# EAGLE schematic F6O2JSZITCH0EP8 (1) (EAGLE 7.6.0)
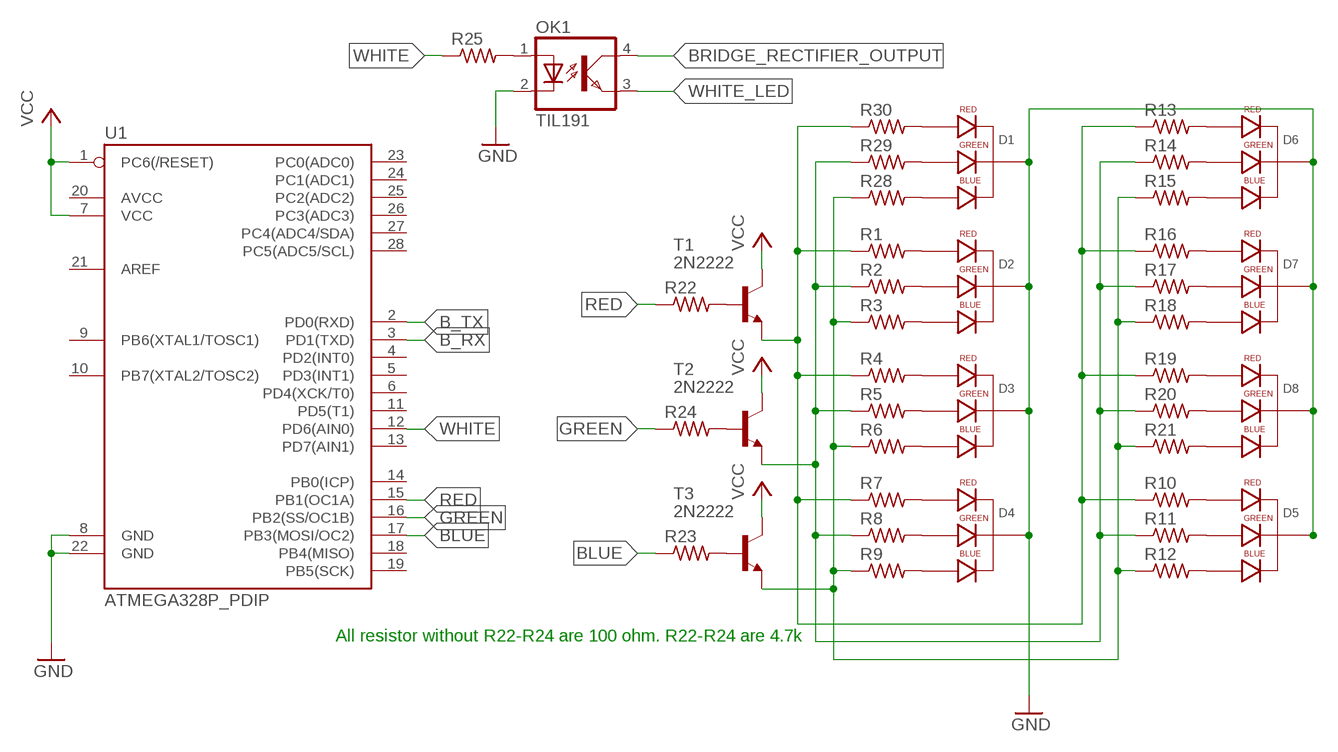
[diagram p0: schematic, sheet 1]

## Parts
D1  LED-RGB-CC-THRUCLEAR  [LED-RGB-THRU]
D2  LED-RGB-CC-THRUCLEAR  [LED-RGB-THRU]
D3  LED-RGB-CC-THRUCLEAR  [LED-RGB-THRU]
D4  LED-RGB-CC-THRUCLEAR  [LED-RGB-THRU]
D5  LED-RGB-CC-THRUCLEAR  [LED-RGB-THRU]
D6  LED-RGB-CC-THRUCLEAR  [LED-RGB-THRU]
D7  LED-RGB-CC-THRUCLEAR  [LED-RGB-THRU]
D8  LED-RGB-CC-THRUCLEAR  [LED-RGB-THRU]
OK1  TIL191  [DIL04]
R1  R-US_0309/10  [0309/10]
R2  R-US_0309/10  [0309/10]
R3  R-US_0309/10  [0309/10]
R4  R-US_0309/10  [0309/10]
R5  R-US_0309/10  [0309/10]
R6  R-US_0309/10  [0309/10]
R7  R-US_0309/10  [0309/10]
R8  R-US_0309/10  [0309/10]
R9  R-US_0309/10  [0309/10]
R10  R-US_0309/10  [0309/10]
R11  R-US_0309/10  [0309/10]
R12  R-US_0309/10  [0309/10]
R13  R-US_0309/10  [0309/10]
R14  R-US_0309/10  [0309/10]
R15  R-US_0309/10  [0309/10]
R16  R-US_0309/10  [0309/10]
R17  R-US_0309/10  [0309/10]
R18  R-US_0309/10  [0309/10]
R19  R-US_0309/10  [0309/10]
R20  R-US_0309/10  [0309/10]
R21  R-US_0309/10  [0309/10]
R22  R-US_0309/10  [0309/10]
R23  R-US_0309/10  [0309/10]
R24  R-US_0309/10  [0309/10]
R25  R-US_0309/10  [0309/10]
R28  R-US_0309/10  [0309/10]
R29  R-US_0309/10  [0309/10]
R30  R-US_0309/10  [0309/10]
T1  2N2222  [TO18]
T2  2N2222  [TO18]
T3  2N2222  [TO18]
U1  ATMEGA328P_PDIP  [DIL28-3]

## Nets
B_RX: U1.3(PD1(TXD))
B_TX: U1.2(PD0(RXD))
BLUE: R23.1 U1.17(PB3(MOSI/OC2))
BRIDGE_RECTIFIER_OUTPUT: OK1.4(COL)
GND: D1.2(CATHODE) D2.2(CATHODE) D3.2(CATHODE) D4.2(CATHODE) D5.2(CATHODE) D6.2(CATHODE) D7.2(CATHODE) D8.2(CATHODE) OK1.2(C) U1.8(GND) U1.22(GND)
GREEN: R24.1 U1.16(PB2(SS/OC1B))
N$1: OK1.1(A) R25.2
N$2: D1.1(RED_CATHODE) R30.2
N$3: D1.3(GREEN_CATHODE) R29.2
N$4: D1.4(BLUE_CATHODE) R28.2
N$5: D2.1(RED_CATHODE) R1.2
N$6: D2.3(GREEN_CATHODE) R2.2
N$7: D2.4(BLUE_CATHODE) R3.2
N$8: D3.1(RED_CATHODE) R4.2
N$9: D3.3(GREEN_CATHODE) R5.2
N$10: D3.4(BLUE_CATHODE) R6.2
N$11: D4.1(RED_CATHODE) R7.2
N$12: D4.3(GREEN_CATHODE) R8.2
N$13: D4.4(BLUE_CATHODE) R9.2
N$14: D5.1(RED_CATHODE) R10.2
N$15: D5.3(GREEN_CATHODE) R11.2
N$16: D5.4(BLUE_CATHODE) R12.2
N$17: D6.1(RED_CATHODE) R13.2
N$18: D6.3(GREEN_CATHODE) R14.2
N$19: D6.4(BLUE_CATHODE) R15.2
N$20: D7.1(RED_CATHODE) R16.2
N$21: D7.3(GREEN_CATHODE) R17.2
N$22: D7.4(BLUE_CATHODE) R18.2
N$23: D8.1(RED_CATHODE) R19.2
N$24: D8.3(GREEN_CATHODE) R20.2
N$25: D8.4(BLUE_CATHODE) R21.2
N$26: R22.2 T1.2(B)
N$27: R23.2 T3.2(B)
N$28: R24.2 T2.2(B)
N$29: R1.1 R4.1 R7.1 R10.1 R13.1 R16.1 R19.1 R30.1 T1.1(E)
N$33: R2.1 R5.1 R8.1 R11.1 R14.1 R17.1 R20.1 R29.1 T2.1(E)
N$34: R3.1 R6.1 R9.1 R12.1 R15.1 R18.1 R21.1 R28.1 T3.1(E)
RED: R22.1 U1.15(PB1(OC1A))
VCC: T1.3(C) T2.3(C) T3.3(C) U1.1(PC6(/RESET)) U1.7(VCC)
WHITE: R25.1 U1.12(PD6(AIN0))
WHITE_LED: OK1.3(EMIT)
Unconnected: U1.4(PD2(INT0)) U1.5(PD3(INT1)) U1.6(PD4(XCK/T0)) U1.9(PB6(XTAL1/TOSC1)) U1.10(PB7(XTAL2/TOSC2)) U1.11(PD5(T1)) U1.13(PD7(AIN1)) U1.14(PB0(ICP)) U1.18(PB4(MISO)) U1.19(PB5(SCK)) U1.20(AVCC) U1.21(AREF) U1.23(PC0(ADC0)) U1.24(PC1(ADC1)) U1.25(PC2(ADC2)) U1.26(PC3(ADC3)) U1.27(PC4(ADC4/SDA)) U1.28(PC5(ADC5/SCL))

## Notes on the sheet
- All resistor without R22-R24 are 100 ohm. R22-R24 are 4.7k

## Library data of the parts
D1-D8 = SparkFun-LED:LED-RGB-CC-THRU: RGB Through-hole common cathode LED SparkFun Storefront: COM-00105 (Clear) COM-09264 (Diffuse); PROD_ID: DIO-08418
OK1 = optocoupler:TIL191: TEXAS INSTRUMENTS OPTO COUPLER; OC_FARNELL: 1683363; OC_NEWARK: unknown
R1-R25 R28-R30 = resistor:R-US_: RESISTOR, American symbol
T1-T3 = transistor:2N2222: NPN TRANSISTOR
U1 = SparkFun-DigitalIC:ATMEGA328P_PDIP: uC used in the Arduino 32kb flash, 1k EEPROM, 2k SRAM This is the through-hole version of this chip.